# Altium schematic sheet AnalogFE.SchDoc: Analog Front-End
size A2; DrawnBy: Tim Vrakas; Engineer: Tim Vrakas
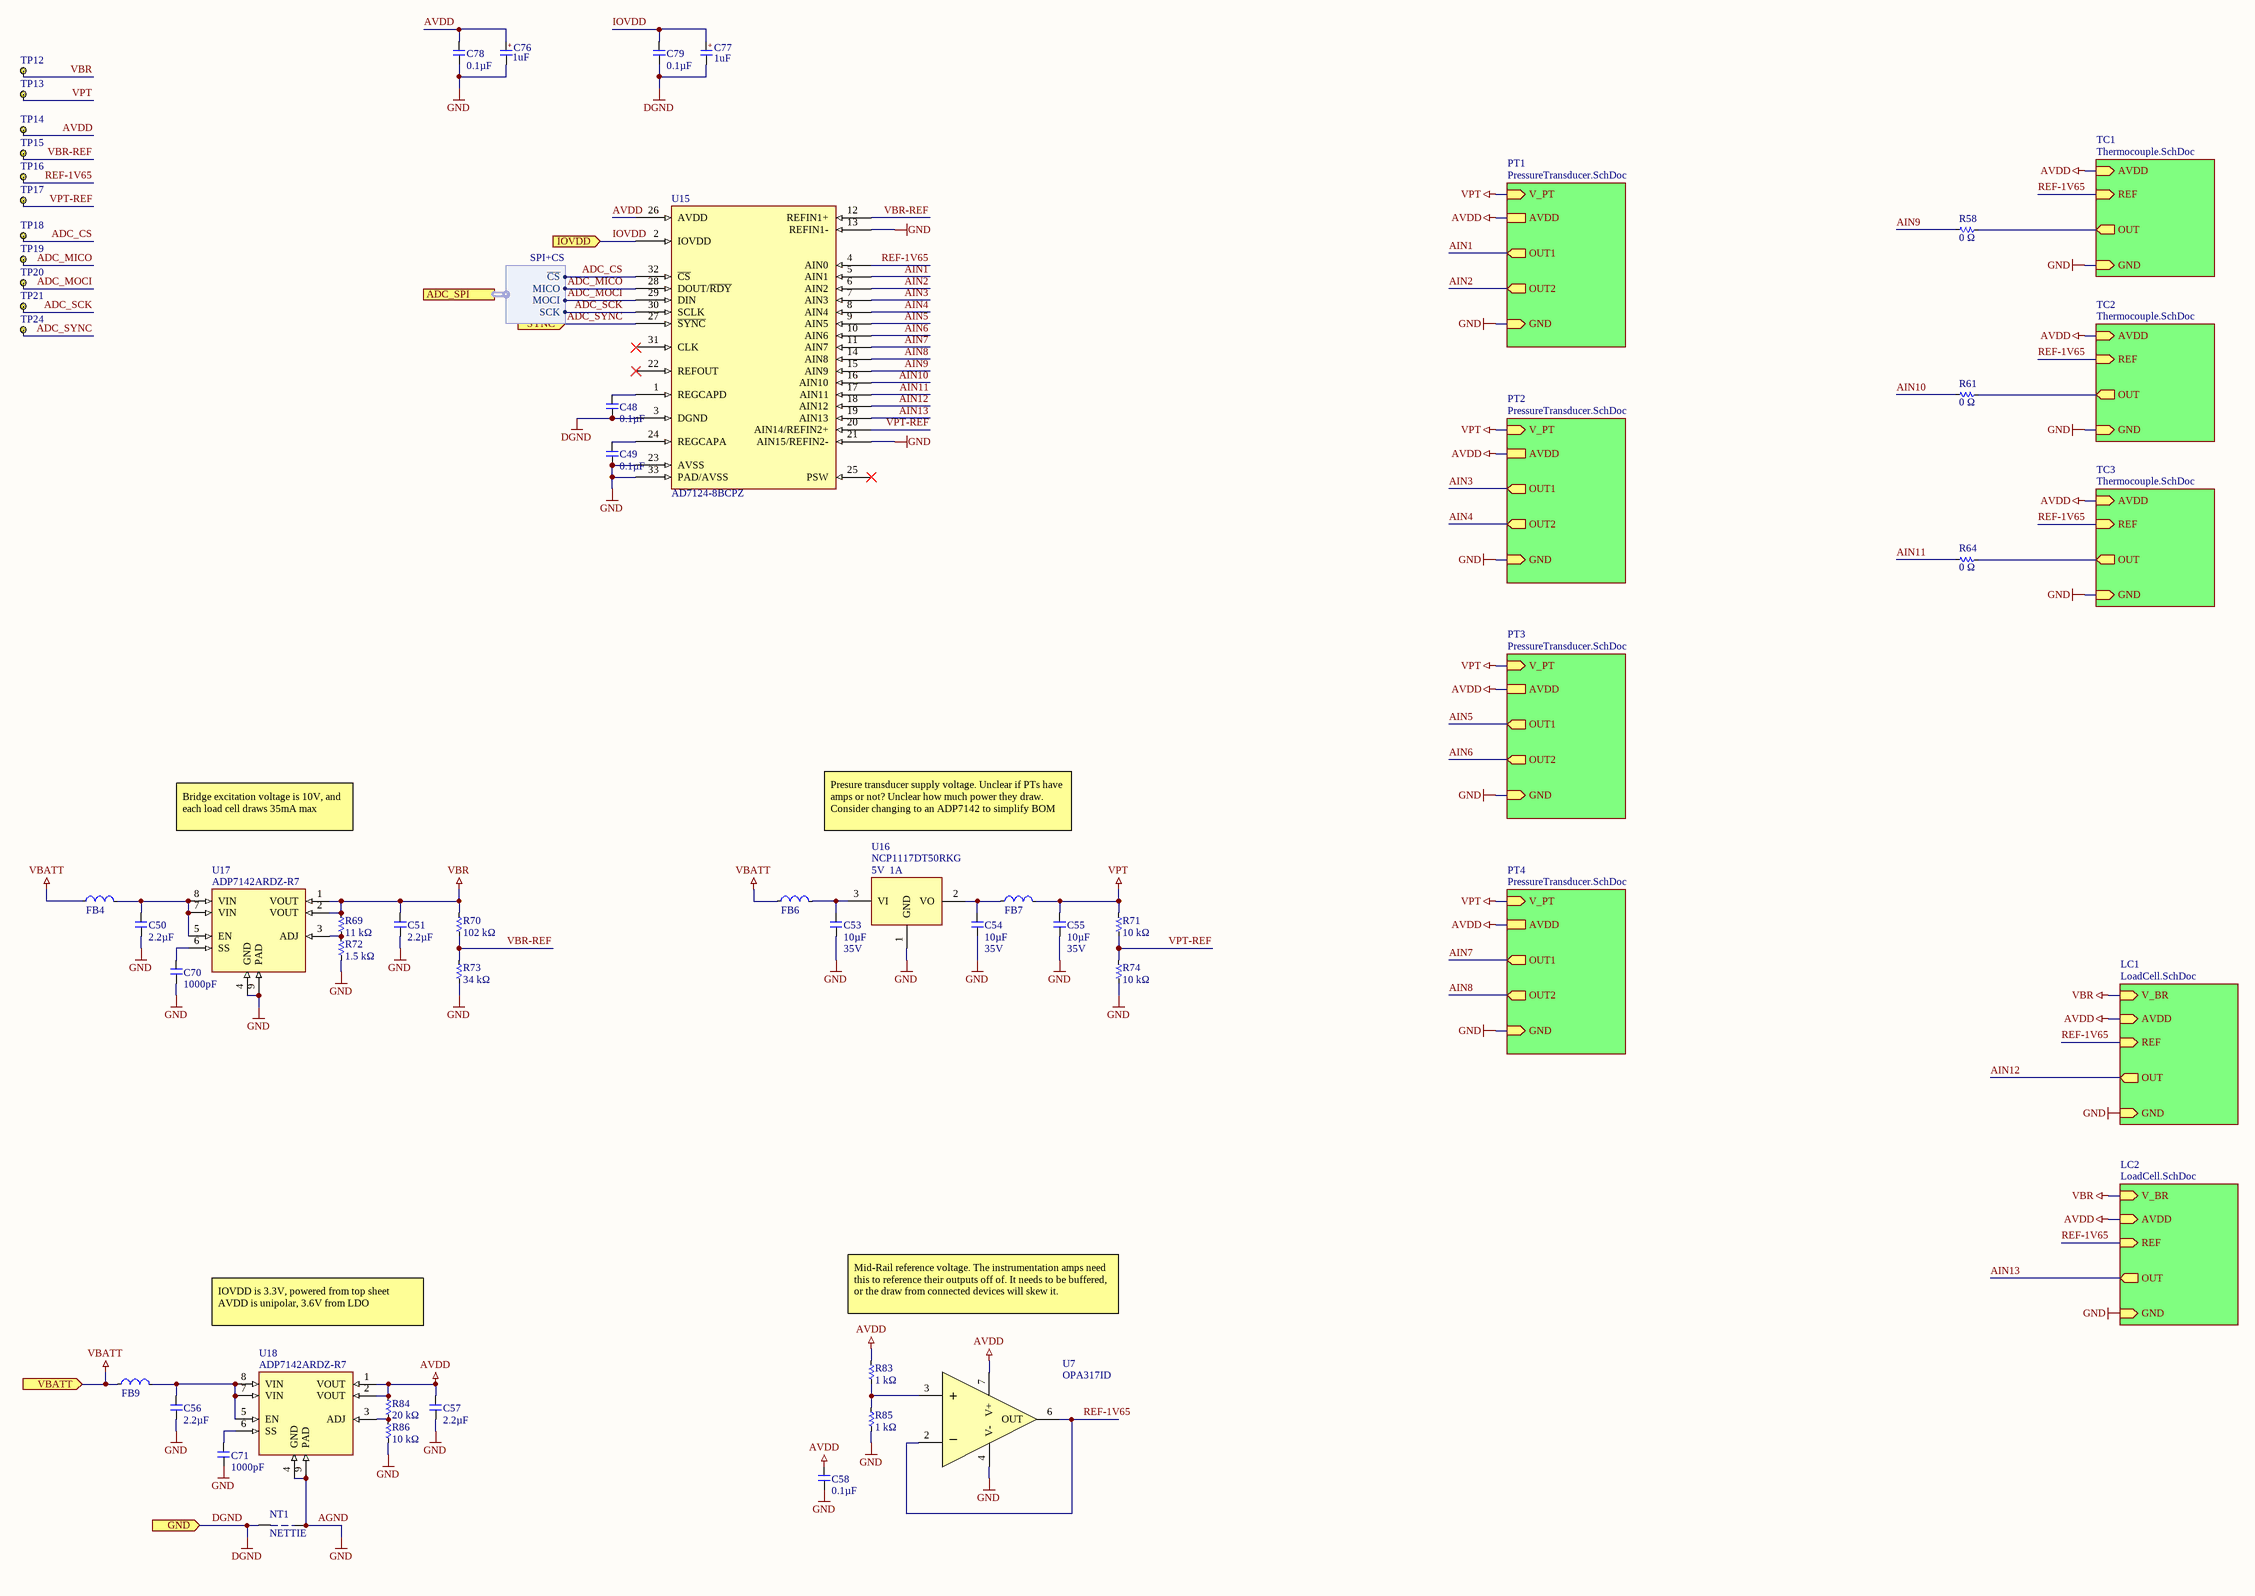
[diagram p0: AnalogFE.SchDoc]

## Parts
C48  Capacitance (shorthand): 0.1µF  [C0603]  (hidden comment: 490-1519-1-ND)
C49  Capacitance (shorthand): 0.1µF  [C0603]  (hidden comment: 490-1519-1-ND)
C50  Capacitance (shorthand): 2.2µF  [C0603]  (hidden comment: 490-10731-1-ND)
C51  Capacitance (shorthand): 2.2µF  [C0603]  (hidden comment: 490-10731-1-ND)
C53  Capacitance (shorthand): 10µF  Rated Voltage: 35V  [C0603]  (hidden comment: 490-13248-1-ND)
C54  Capacitance (shorthand): 10µF  Rated Voltage: 35V  [C0603]  (hidden comment: 490-13248-1-ND)
C55  Capacitance (shorthand): 10µF  Rated Voltage: 35V  [C0603]  (hidden comment: 490-13248-1-ND)
C56  Capacitance (shorthand): 2.2µF  [C0603]  (hidden comment: 490-10731-1-ND)
C57  Capacitance (shorthand): 2.2µF  [C0603]  (hidden comment: 490-10731-1-ND)
C58  Capacitance (shorthand): 0.1µF  [C0603]  (hidden comment: 490-1519-1-ND)
C70  Capacitance (shorthand): 1000pF  [C0603]  (hidden comment: 490-1494-1-ND)
C71  Capacitance (shorthand): 1000pF  [C0603]  (hidden comment: 490-1494-1-ND)
C76  Capacitance: 1uF  [C0603P]  (hidden comment: TACL105K010XTA)
C77  Capacitance: 1uF  [C0603P]  (hidden comment: TACL105K010XTA)
C78  Capacitance (shorthand): 0.1µF  [C0603]  (hidden comment: 490-1519-1-ND)
C79  Capacitance (shorthand): 0.1µF  [C0603]  (hidden comment: 490-1519-1-ND)
FB4  FB_120@100MHz_0603  [C0603]  (value not drawn)
FB6  FB_120@100MHz_0603  [C0603]  (value not drawn)
FB7  FB_120@100MHz_0603  [C0603]  (value not drawn)
FB9  FB_120@100MHz_0603  [C0603]  (value not drawn)
NT1  NETTIE  [NETTIE_10MIL]  (net tie, no BOM)
R58  Resistance: 0 Ω  [R0603]  (hidden comment: 311-0.0HRCT-ND)
R61  Resistance: 0 Ω  [R0603]  (hidden comment: 311-0.0HRCT-ND)
R64  Resistance: 0 Ω  [R0603]  (hidden comment: 311-0.0HRCT-ND)
R69  Resistance: 11 kΩ  [R0603]  (hidden comment: 311-11.0KHRCT-ND)
R70  Resistance: 102 kΩ  [R0603]  (hidden comment: 311-102KHRCT-ND)
R71  Resistance: 10 kΩ  [R0603]  (hidden comment: 311-10.0KHRCT-ND)
R72  Resistance: 1.5 kΩ  [R0603]  (hidden comment: 311-1.50KHRCT-ND)
R73  Resistance: 34 kΩ  [R0603]  (hidden comment: 311-34.0KHRCT-ND)
R74  Resistance: 10 kΩ  [R0603]  (hidden comment: 311-10.0KHRCT-ND)
R83  Resistance: 1 kΩ  [R0603]  (hidden comment: 311-1.00KHRCT-ND)
R84  Resistance: 20 kΩ  [R0603]  (hidden comment: 311-20.0KHRCT-ND)
R85  Resistance: 1 kΩ  [R0603]  (hidden comment: 311-1.00KHRCT-ND)
R86  Resistance: 10 kΩ  [R0603]  (hidden comment: 311-10.0KHRCT-ND)
TP12  TEST_POINT_BLACK_KEYSTONE_5001  [TEST_POINT_BLACK_KEYSTONE_5001-Footprint-1]  (value not drawn)
TP13  TEST_POINT_BLACK_KEYSTONE_5001  [TEST_POINT_BLACK_KEYSTONE_5001-Footprint-1]  (value not drawn)
TP14  TEST_POINT_BLACK_KEYSTONE_5001  [TEST_POINT_BLACK_KEYSTONE_5001-Footprint-1]  (value not drawn)
TP15  TEST_POINT_BLACK_KEYSTONE_5001  [TEST_POINT_BLACK_KEYSTONE_5001-Footprint-1]  (value not drawn)
TP16  TEST_POINT_BLACK_KEYSTONE_5001  [TEST_POINT_BLACK_KEYSTONE_5001-Footprint-1]  (value not drawn)
TP17  TEST_POINT_BLACK_KEYSTONE_5001  [TEST_POINT_BLACK_KEYSTONE_5001-Footprint-1]  (value not drawn)
TP18  TEST_POINT_BLACK_KEYSTONE_5001  [TEST_POINT_BLACK_KEYSTONE_5001-Footprint-1]  (value not drawn)
TP19  TEST_POINT_BLACK_KEYSTONE_5001  [TEST_POINT_BLACK_KEYSTONE_5001-Footprint-1]  (value not drawn)
TP20  TEST_POINT_BLACK_KEYSTONE_5001  [TEST_POINT_BLACK_KEYSTONE_5001-Footprint-1]  (value not drawn)
TP21  TEST_POINT_BLACK_KEYSTONE_5001  [TEST_POINT_BLACK_KEYSTONE_5001-Footprint-1]  (value not drawn)
TP24  TEST_POINT_BLACK_KEYSTONE_5001  [TEST_POINT_BLACK_KEYSTONE_5001-Footprint-1]  (value not drawn)
U7  OPA317ID  [SOIC127P600X175-8N]
U15  AD7124-8BCPZ  [QFN50P500X500X75_HS-33N]
U16  Manufacturer Part Number: NCP1117DT50RKG  Voltage - Output: 5V  Current - Output: 1A  [DPAK]  (hidden comment: LDO_NCP1117DT50RKG)
U17  ADP7142ARDZ-R7  [SOIC127P600X175_HS-9N]
U18  ADP7142ARDZ-R7  [SOIC127P600X175_HS-9N]

## Sub-sheets
LC1 = LoadCell.SchDoc: REF (in), GND (in), OUT (out), V_BR (in), AVDD (in)
LC2 = LoadCell.SchDoc: REF (in), GND (in), OUT (out), V_BR (in), AVDD (in)
PT1 = PressureTransducer.SchDoc: V_PT (in), AVDD, GND (in), OUT1 (out), OUT2 (out)
PT2 = PressureTransducer.SchDoc: V_PT (in), AVDD, GND (in), OUT1 (out), OUT2 (out)
PT3 = PressureTransducer.SchDoc: V_PT (in), AVDD, GND (in), OUT1 (out), OUT2 (out)
PT4 = PressureTransducer.SchDoc: V_PT (in), AVDD, GND (in), OUT1 (out), OUT2 (out)
TC1 = Thermocouple.SchDoc: GND (in), REF (in), AVDD (in), OUT (out)
TC2 = Thermocouple.SchDoc: GND (in), REF (in), AVDD (in), OUT (out)
TC3 = Thermocouple.SchDoc: GND (in), REF (in), AVDD (in), OUT (out)

## Ports
ADC_SPI (harness SPI+CS), GND (in), IOVDD (in), SYNC (in), VBATT (in)

## Harnesses
SPI+CS: SCK, MOCI, MICO, ~{CS}

## Nets
AGND: C49.1 C50.2 C51.2 C53.2 C54.2 C55.2 C56.2 C57.2 C58.2 C70.2 C71.2 C76.2(K) C78.2 NT1.2 R72.1 R73.1 R74.1 R85.1 R86.1 U7.4(V-) U15.13(REFIN1-) U15.21(AIN15/REFIN2-) U15.23(AVSS) U15.33(PAD/AVSS) U16.1(GND) U17.4(GND) U17.9(PAD) U18.4(GND) U18.9(PAD) ; sheet LC1/GND, sheet PT1/GND, sheet TC1/GND, sheet TC2/GND, sheet TC3/GND, sheet LC2/GND, sheet PT2/GND, sheet PT3/GND, sheet PT4/GND  [also labelled GND]
AVDD: C57.1 C58.1 C76.1(A) C78.1 R83.2 R84.2 TP14.1 U7.7(V+) U15.26(AVDD) U18.1(VOUT) U18.2(VOUT) ; sheet LC1/AVDD, sheet PT1/AVDD, sheet TC1/AVDD, sheet TC2/AVDD, sheet TC3/AVDD, sheet LC2/AVDD, sheet PT2/AVDD, sheet PT3/AVDD, sheet PT4/AVDD
DGND: C48.2 C77.2(K) C79.2 NT1.1 U15.3(DGND) ; port GND
VBATT: FB4.1 FB6.1 FB9.1 ; port VBATT
VBR: C51.1 R69.2 R70.2 TP12.1 U17.1(VOUT) U17.2(VOUT) ; sheet LC1/V_BR, sheet LC2/V_BR
VPT: C55.1 FB7.2 R71.2 TP13.1 ; sheet PT1/V_PT, sheet PT2/V_PT, sheet PT3/V_PT, sheet PT4/V_PT
ADC_CS: TP18.1 U15.32(~{CS}) ; port ADC_SPI.~{CS}
ADC_MICO: TP19.1 U15.28(DOUT/~{RDY}) ; port ADC_SPI.MICO
ADC_MOCI: TP20.1 U15.29(DIN) ; port ADC_SPI.MOCI
ADC_SCK: TP21.1 U15.30(SCLK) ; port ADC_SPI.SCK
ADC_SYNC: TP24.1 U15.27(~{SYNC}) ; port SYNC
AIN1: U15.5(AIN1) ; sheet PT1/OUT1
AIN2: U15.6(AIN2) ; sheet PT1/OUT2
AIN3: U15.7(AIN3) ; sheet PT2/OUT1
AIN4: U15.8(AIN4) ; sheet PT2/OUT2
AIN5: U15.9(AIN5) ; sheet PT3/OUT1
AIN6: U15.10(AIN6) ; sheet PT3/OUT2
AIN7: U15.11(AIN7) ; sheet PT4/OUT1
AIN8: U15.14(AIN8) ; sheet PT4/OUT2
AIN9: R58.2 U15.15(AIN9)
AIN10: R61.2 U15.16(AIN10)
AIN11: R64.2 U15.17(AIN11)
AIN12: U15.18(AIN12) ; sheet LC1/OUT
AIN13: U15.19(AIN13) ; sheet LC2/OUT
IOVDD: C77.1(A) C79.1 U15.2(IOVDD) ; port IOVDD
REF-1V65: TP16.1 U7.2(-) U7.6(OUT) U15.4(AIN0) ; sheet LC1/REF, sheet TC1/REF, sheet TC2/REF, sheet TC3/REF, sheet LC2/REF
VBR-REF: R70.1 R73.2 TP15.1 U15.12(REFIN1+)
VPT-REF: R71.1 R74.2 TP17.1 U15.20(AIN14/REFIN2+)
NetC48_1: C48.1 U15.1(REGCAPD)
NetC49_2: C49.2 U15.24(REGCAPA)
NetC50_1: C50.1 FB4.2 U17.5(EN) U17.7(VIN) U17.8(VIN)
NetC53_1: C53.1 FB6.2 U16.3(VI)
NetC54_1: C54.1 FB7.1 U16.2(VO)
NetC56_1: C56.1 FB9.2 U18.5(EN) U18.7(VIN) U18.8(VIN)
NetC70_1: C70.1 U17.6(SS)
NetC71_1: C71.1 U18.6(SS)
NetR58_1: R58.1 ; sheet TC1/OUT
NetR61_1: R61.1 ; sheet TC2/OUT
NetR64_1: R64.1 ; sheet TC3/OUT
NetR69_1: R69.1 R72.2 U17.3(ADJ)
NetR83_1: R83.1 R85.2 U7.3(+)
NetR84_1: R84.1 R86.2 U18.3(ADJ)

Not connected (* = marked no-connect by the designer): U15 22(REFOUT)* 25(PSW)* 31(CLK)*

## Notes on the sheet
- Bridge excitation voltage is 10V, and each load cell draws 35mA max
- Presure transducer supply voltage. Unclear if PTs have amps or not? Unclear how much power they draw.
  Consider changing to an ADP7142 to simplify BOM
- Mid-Rail reference voltage. The instrumentation amps need this to reference their outputs off of. It needs to be buffered, or the draw from connected devices will skew it.
- IOVDD is 3.3V, powered from top sheet
  AVDD is unipolar, 3.6V from LDO
- (in symbol CMP-00030-1) _
- (in symbol CMP-00032-1) +

## Library data of the parts
C48 C49 C78 = CMP-119-0065-1: CAP CER 0603 0.1µF X7R 50V 10%; Manufacturer: Murata Electronics North America; Capacitance - pF (Machine readable): #NAME?; Rule: UNIONINDEX=0|RULEKIND=PolygonConnect|NETSCOPE=AnyNet|LAYERKIND=SameLayer|NAME=Schematic Polygon Connect Style|CONNECTSTYLE=Direct|RELIEFCONDUCTORWIDTH=10mil|RELIEFENTRIES=4|POLYGONRELIEFANGLE=45 Angle|AIRGAPWIDTH=10mil|UNIT=Imperial; Dielectric: X7R; Rated Voltage: 50V
C50 C51 C56 C57 = CMP-119-0069-1: CAP CER 2.2UF 16V X5R 0603 10%; Manufacturer: Murata Electronics North America; Capacitance - pF (Machine readable): #NAME?; Rated Voltage: 25V; Dielectric: X5R
C53-C55 = CMP-119-0071-1: CAP CER 10UF 35V X5R 0603 20%; Manufacturer: Murata Electronics North America; Capacitance - pF (Machine readable): #NAME?; Dielectric: X5R
C58 = CMP-119-0065-1: CAP CER 0603 0.1µF X7R 50V 10%; Manufacturer: Murata Electronics North America; Capacitance - pF (Machine readable): #NAME?; Dielectric: X7R; Rated Voltage: 50V
C70 C71 = CMP-119-0040-1: CAP CER 0603 1000pF X7R 50V 10%; Manufacturer: Murata Electronics North America; Capacitance - pF (Machine readable): #NAME?; Dielectric: X7R; Rated Voltage: 50V
C76 C77 = CMP-00032-1: Cap Tant Solid 1uF 10V L CASE 10% (1.6 X 0.85 X 0.85mm) SMD 1608-10 7.5 Ohm 125 Plastic T/R; Dissipation Factor: 6%; Dielectric Material: Tantalum; ESR (Equivalent Series Resistance): 7.5R; Leakage Current: 500nA; Polarity: Polar; Rule: PcbType=ProtelPcb; Height - Seated (Max): 0.039inch; Case Code (Imperial): 0603; Package Quantity: 1; Height: 1mm; RoHS Compliant: Yes; Number of Pins: 2; Min Operating Temperature: -55°C; Radiation Hardening: No; Features: General Purpose; Max Operating Temperature: 125°C; Depth: 0.85mm; Length: 1.6mm; Lead Free: Lead Free; Voltage Rating: 10V; Tolerance: 10%; Width: 0.033inch; Case/Package: 0603; Termination: SMD/SMT; Packaging: Tape and Reel; REACH SVHC: No SVHC; Case Code (Metric): 1608; Mount: Surface Mount; Voltage Rating (DC): 10V
C79 = CMP-119-0065-1: CAP CER 0603 0.1µF X7R 50V 10%; Manufacturer: Murata Electronics North America; Capacitance - pF (Machine readable): #NAME?; Rule: PcbType=ProtelPcb; Dielectric: X7R; Rated Voltage: 50V
FB4 FB6 FB7 FB9 = CMP-051-0015-1: FERRITE BEAD 120 OHM @ 100 MHz; Manufacturer: Taiyo Yuden; Manufacturer Part Number: BKP1608HS121-T; Filter Type: Power Line; Number of Lines: 1; Current Rating (Max): 2.7A; DC Resistance (DCR) (Max): 35 mOhm; RoHS: RoHS Compliant; Stock 1: 47959; Pricing 1: 1=0.1, 10=0.059, 25=0.052, 50=0.0474, 100=0.0426, 250=0.0312, 500=0.0227, 1000=0.02223 (USD); Packaging: Cut Tape (CT); Part Status: Active; Ratings: -; Operating Temperature: -55°C ~ 85°C; Package / Case: 0603 (1608 Metric); Mounting Type: Surface Mount; Height (Max): 0.037" (0.95mm); Size / Dimension: 0.063" L x 0.031" W (1.60mm x 0.80mm); ComponentLink1URL: http://ds.yuden.co.jp/TYCOMPAS/ut/detail.do?productNo=BKP1608HS121-T&fileName=BKP1608HS121-T_SS&mode=specSheetDownload; ComponentLink1Description: http://ds.yuden.co.jp/TYCOMPAS/ut/detail.do?productNo=BKP1608HS121-T&fileName=BKP1608HS121-T_SS&mode=specSheetDownload; Impedance @ Frequency: 120 Ohm @ 100MHz; Design Item ID: FB_120@100MHz_0603; Source: inductor.SchLib
NT1 = CMP-057-0001-1: Net tie. Use sparingly.; Source: miscellaneous.SchLib; Design Item ID: NETTIE
R58 R61 R64 = CMP-126-0000-2: RES SMD 0 OHM JUMPER 1/10W 0603; Manufacturer Part Number: RC0603FR-070RL; Manufacturer: Yageo; Power (Watts): 0.1W, 1/10W; Resistance (Sortable): 0; Tolerance: Jumper; Temperature Coefficient: -; Operating Temperature: -55°C ~ 155°C; Image: //media.digikey.com/Renders/Yageo%20Renders/0603-(1608-Metric).jpg; Datasheets: http://www.yageo.com/documents/recent/PYu-RC_Group_51_RoHS_L_9.pdf
R69 = CMP-126-0277-2: RES SMD 11K OHM 1% 1/10W 0603; Manufacturer Part Number: RC0603FR-0711KL; Manufacturer: Yageo; Power (Watts): 0.1W, 1/10W; Resistance (Sortable): 11000; Temperature Coefficient: ±100ppm/°C; Datasheets: http://www.yageo.com/documents/recent/PYu-RC_Group_51_RoHS_L_9.pdf; Image: //media.digikey.com/Renders/Yageo%20Renders/0603-(1608-Metric).jpg; Tolerance: ±1%; Operating Temperature: -55°C ~ 155°C
R70 = CMP-126-0383-2: RES SMD 102K OHM 1% 1/10W 0603; Manufacturer: Yageo; Manufacturer Part Number: RC0603FR-07102KL; Power (Watts): 0.1W, 1/10W; Resistance (Sortable): 102000; Temperature Coefficient: ±100ppm/°C; Operating Temperature: -55°C ~ 155°C; Datasheets: http://www.yageo.com/documents/recent/PYu-RC_Group_51_RoHS_L_9.pdf; Image: //media.digikey.com/Renders/Yageo%20Renders/0603-(1608-Metric).jpg; Tolerance: ±1%
R71 = CMP-126-0273-2: RES SMD 10K OHM 1% 1/10W 0603; Manufacturer: Yageo; Manufacturer Part Number: RC0603FR-0710KL; Power (Watts): 0.1W, 1/10W; Resistance (Sortable): 10000; Temperature Coefficient: ±100ppm/°C; Operating Temperature: -55°C ~ 155°C; Datasheets: http://www.yageo.com/documents/recent/PYu-RC_Group_51_RoHS_L_9.pdf; Image: //media.digikey.com/Renders/Yageo%20Renders/0603-(1608-Metric).jpg; Tolerance: ±1%
R72 = CMP-126-0187-2: RES SMD 1.5K OHM 1% 1/10W 0603; Manufacturer: Yageo; Manufacturer Part Number: RC0603FR-071K5L; Temperature Coefficient: ±100ppm/°C; Resistance (Sortable): 1500; Power (Watts): 0.1W, 1/10W; Image: //media.digikey.com/Renders/Yageo%20Renders/0603-(1608-Metric).jpg; Tolerance: ±1%; Datasheets: http://www.yageo.com/documents/recent/PYu-RC_Group_51_RoHS_L_9.pdf; Operating Temperature: -55°C ~ 155°C
R73 = CMP-126-0331-2: RES SMD 34K OHM 1% 1/10W 0603; Manufacturer: Yageo; Manufacturer Part Number: RC0603FR-0734KL; Resistance (Sortable): 34000; Temperature Coefficient: ±100ppm/°C; Power (Watts): 0.1W, 1/10W; Image: //media.digikey.com/Renders/Yageo%20Renders/0603-(1608-Metric).jpg; Tolerance: ±1%; Operating Temperature: -55°C ~ 155°C; Datasheets: http://www.yageo.com/documents/recent/PYu-RC_Group_51_RoHS_L_9.pdf
R74 = CMP-126-0273-2: RES SMD 10K OHM 1% 1/10W 0603; Manufacturer: Yageo; Manufacturer Part Number: RC0603FR-0710KL; Resistance (Sortable): 10000; Temperature Coefficient: ±100ppm/°C; Power (Watts): 0.1W, 1/10W; Image: //media.digikey.com/Renders/Yageo%20Renders/0603-(1608-Metric).jpg; Tolerance: ±1%; Operating Temperature: -55°C ~ 155°C; Datasheets: http://www.yageo.com/documents/recent/PYu-RC_Group_51_RoHS_L_9.pdf
R83 R85 = CMP-126-0172-2: RES SMD 1K OHM 1% 1/10W 0603; Manufacturer: Yageo; Manufacturer Part Number: RC0603FR-071KL; Power (Watts): 0.1W, 1/10W; Resistance (Sortable): 1000; Temperature Coefficient: ±100ppm/°C; Image: //media.digikey.com/Renders/Yageo%20Renders/0603-(1608-Metric).jpg; Operating Temperature: -55°C ~ 155°C; Tolerance: ±1%; Datasheets: http://www.yageo.com/documents/recent/PYu-RC_Group_51_RoHS_L_9.pdf
R84 = CMP-126-0304-2: RES SMD 20K OHM 1% 1/10W 0603; Manufacturer Part Number: RC0603FR-0720KL; Manufacturer: Yageo; Temperature Coefficient: ±100ppm/°C; Power (Watts): 0.1W, 1/10W; Resistance (Sortable): 20000; Datasheets: http://www.yageo.com/documents/recent/PYu-RC_Group_51_RoHS_L_9.pdf; Tolerance: ±1%; Operating Temperature: -55°C ~ 155°C; Image: //media.digikey.com/Renders/Yageo%20Renders/0603-(1608-Metric).jpg
R86 = CMP-126-0273-2: RES SMD 10K OHM 1% 1/10W 0603; Manufacturer Part Number: RC0603FR-0710KL; Manufacturer: Yageo; Power (Watts): 0.1W, 1/10W; Temperature Coefficient: ±100ppm/°C; Resistance (Sortable): 10000; Tolerance: ±1%; Operating Temperature: -55°C ~ 155°C; Datasheets: http://www.yageo.com/documents/recent/PYu-RC_Group_51_RoHS_L_9.pdf; Image: //media.digikey.com/Renders/Yageo%20Renders/0603-(1608-Metric).jpg
TP12-TP21 TP24 = CMP-055-0004-2: BLACK T/H TEST POINT; Manufacturer Part Number: 5001; Manufacturer: Keystone Electronics; Material - Body: Phosphor Bronze; Material - Insulation: Nylon 46, UL 94V-0; Plating: Silver; ComponentLink1Description: http://www.keyelco.com/product-pdf.cfm?p=1310; Source: mechanical.SchLib; Part Status: Active; Stock 1: 718799; RoHS: RoHS Compliant; Packaging: Bulk; Mounting Type: 0.040" (1.02mm) Hole Diameter; ComponentLink1URL: http://www.keyelco.com/product-pdf.cfm?p=1310; Pricing 1: 1=0.37, 10=0.316, 50=0.2298, 100=0.2209, 250=0.19832, 500=0.18932, 1000=0.1616, 2500=0.14424, 5000=0.13523 (USD); Size / Dimension: 0.100" Dia x 0.180" L (2.54mm x 4.57mm); Color: Black; Design Item ID: TEST_POINT_BLACK_KEYSTONE_5001
U7 = CMP-00030-1: Op Amp Single Precision Amplifier R-R I/O ±2.75V/5.5V 8-Pin SOIC Tube; Number of Channels: 1; Max Supply Voltage: 5.5V; Voltage Gain: 110dB; Input Bias Current: 275pA; Slew Rate: 0.15V/µs; Common Mode Rejection Ratio: 95dB; Operating Supply Current: 21uA; Input Voltage Noise Density: 55nV/sqrt Hz; Min Supply Voltage: 1.8V; Input Offset Voltage (Vos): 20uV; Gain Bandwidth Product: 300kHz; Output Current per Channel: 5mA; Max Dual Supply Voltage: 2.75V; Min Dual Supply Voltage: 900mV; REACH SVHC: No SVHC; Lead Free: Lead Free; Number of Circuits: 1; Case/Package: SOIC; Number of Amplifiers: 1; Nominal Supply Current: 21uA; Packaging: Rail/Tube; Max Operating Temperature: 125°C; Min Operating Temperature: -40°C; Bandwidth: 300kHz; Number of Pins: 8; Package Quantity: 75; RoHS Compliant: Yes; Mount: Surface Mount
U15 = CMP-00001-5: ANALOG DEVICES - AD7124-8BCPZ - ADC, 24BIT, 19.2KSPS, SPI, LFCSP-32; Supply Type: Analog,Digital; Quiescent Current: 2.8mA; Input Offset Voltage (Vos): 1mV; Min Supply Voltage: 2.7V; Input Capacitance: 5.5pF; Settling Time: 1us; Sampling Rate: 19.2KS/s; Dual Supply Voltage: 1.8V; Number of Bits: 24; Slew Rate: 20V/µs; Operating Supply Current: 5.6mA; Max Supply Voltage: 3.6V; Polarity: Bipolar,Unipolar; Resolution: 24b; Power Supply Rejection Ratio (PSRR): 95dB; Common Mode Rejection Ratio: 76dB; Number of A/D Converters: 1; Interface: SPI; Max Operating Temperature: 125°C; Min Operating Temperature: -55°C; REACH SVHC: No SVHC; Mount: Surface Mount; Height: 0.75mm; Number of Pins: 32; Packaging: Tray; Width: 5.1mm; Lead Free: Contains Lead; Length: 5.1mm
U16 = CMP-048-0060-1: IC REG LDO 5V 1A DPAK; Manufacturer: ON Semiconductor; Regulator Topology: Positive Fixed; Voltage - Dropout (Typical): 1.07V @ 800mA; Number of Regulators: 1; Voltage - Input: Up to 20V; RoHS: RoHS Compliant; Stock 1: 1849; Pricing 1: 1=0.46, 10=0.391, 100=0.2919, 500=0.22932, 1000=0.17721 (USD); Packaging: Cut Tape (CT); Part Status: Active; Current - Limit (Min): 1A; Operating Temperature: 0°C ~ 125°C; Mounting Type: Surface Mount; Package / Case: TO-252-3, DPak (2 Leads + Tab), SC-63; Supplier Device Package: DPAK-3; ComponentLink1URL: http://www.onsemi.com/pub_link/Collateral/NCP1117-D.PDF; ComponentLink1Description: http://www.onsemi.com/pub_link/Collateral/NCP1117-D.PDF; Source: ic_pmic.SchLib; Design Item ID: LDO_NCP1117DT50RKG
U17 U18 = CMP-00002-2: IC REG LIN POS ADJ 200MA 8SOIC; Dropout Voltage: 200mV; Output Voltage: 39.8V; Max Output Voltage: 39V; Max Input Voltage: 40V; Min Output Voltage: 1.2V; Polarity: Positive; Number of Outputs: 1; Accuracy: 0.8%; Operating Supply Current: 180uA; Quiescent Current: 50uA; Min Input Voltage: 2.7V; Min Current Limit: 250mA; Output Type: Adjustable; Case/Package: SOIC; Package Quantity: 1000; Number of Pins: 8; Contact Plating: Gold; Packaging: Tape and Reel; REACH SVHC: No SVHC; Min Operating Temperature: -40°C; Output Current: 200mA; Number of Regulators: 1; Max Output Current: 200mA; Mount: Surface Mount; Max Operating Temperature: 125°C; Lead Free: Contains Lead